# EAGLE schematic l_meter (EAGLE 6.1)
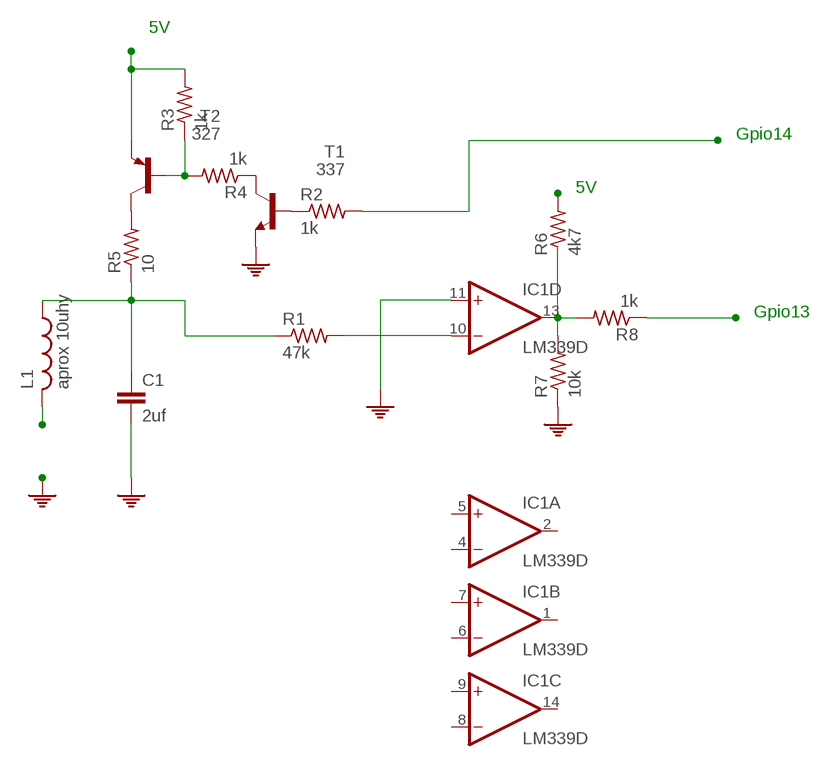
[diagram p0: schematic, sheet 1]

## Parts
C1  2uf  C-EU025-030X050  [C025-030X050]
IC1  LM339D  [SO14]
L1  aprox 10uhy  L-USIRF-46  [IRF46]
R1  47k  R-US_0207/10  [0207/10]
R2  1k  R-US_0207/10  [0207/10]
R3  1k  R-US_0207/10  [0207/10]
R4  1k  R-US_0207/10  [0207/10]
R5  10  R-US_0207/10  [0207/10]
R6  4k7  R-US_0207/10  [0207/10]
R7  10k  R-US_0207/10  [0207/10]
R8  1k  R-US_0207/10  [0207/10]
T1  337  -NPN-SOT23-EBC  [SOT23-EBC]
T2  327  -PNP-TO92  [TO92]

## Nets
N$1: C1.1 L1.1 R1.1 R5.1
N$2: R5.2 T2.3(C)
N$3: R3.1 R4.2 T2.2(B)
N$4: R3.2 T2.1(E)
N$5: L1.2
N$6: R4.1 T1.C
N$7: R2.1 T1.B
N$8: IC1.10(D:-IN) R1.2
N$10: R6.2
N$11: IC1.13(D:OUT) R7.2 R8.2
N$13: R8.1
N$14: R2.2
PE: C1.2 IC1.11(D:+IN) R7.1 T1.E
Unconnected: IC1.1(B:OUT) IC1.2(A:OUT) IC1.4(A:-IN) IC1.5(A:+IN) IC1.6(B:-IN) IC1.7(B:+IN) IC1.8(C:-IN) IC1.9(C:+IN) IC1.14(C:OUT) R6.1

## Notes on the sheet
- 5V
- Gpio14
- 5V
- Gpio13

## Power pins joined to a net without a drawn wire
GND: IC1.12(P:GND)
V+: IC1.3(P:V+)

## Library data of the parts
C1 = rcl:C-EU: CAPACITOR, European symbol
IC1 = linear:LM339: Low Power Low Offset Voltage Quad Comparators with open collector; LM139/LM239/LM339/LM2901/LM3302
L1 = rcl:L-US: INDUCTOR, American symbol
R1-R8 = rcl:R-US_: RESISTOR, American symbol
T1 = transistor:*-NPN-: NPN Transistror BF959 corrected 2008.03.06
T2 = transistor:*-PNP-: PNP Transistror